# Altium schematic sheet 2016_Carte_Batteries.SchDoc
size A4
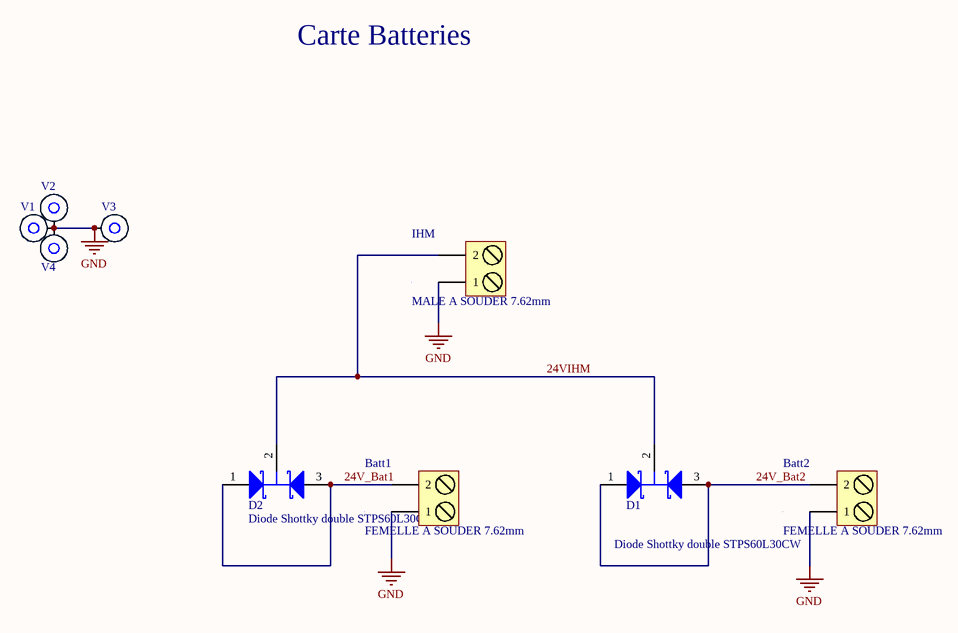
[diagram p0: 2016_Carte_Batteries.SchDoc]

## Parts
Batt1  FEMELLE A SOUDER 7.62mm  [BORNIER2_FEM_COUDE]
Batt2  FEMELLE A SOUDER 7.62mm  [BORNIER2_FEM_COUDE]
D1  Diode Shottky double STPS60L30CW  [TO247]
D2  Diode Shottky double STPS60L30CW  [TO247]
IHM  MALE A SOUDER 7.62mm  [BORNIER2_FEM_HORIZ]
V1  (no value)  [ENTRETOISE_CMS]
V2  (no value)  [ENTRETOISE_CMS]
V3  (no value)  [ENTRETOISE_CMS]
V4  (no value)  [ENTRETOISE_CMS]

## Nets
GND: Batt1.1 Batt2.1 IHM.1 V1.1 V2.1 V3.1 V4.1
24V_Bat1: Batt1.2 D2.1(A1) D2.3(A2)
24V_Bat2: Batt2.2 D1.1(A1) D1.3(A2)
24VIHM: D1.2(K) D2.2(K) IHM.2

## Notes on the sheet
- Carte Batteries
- Title
- Size:
- Date:
- A4
- Number:
- Time:
- Revision:
- Sheet
- of
- File:

## Library data of the parts
Batt1 Batt2 IHM = BORNIER2: Terminal blocks, 2 pins, pitch=5mm
D1 D2 = Diode Shottky double STPS60L30CW: DIODE SCHOTTKY DOUBLE; Manufacturer Part Number: BAT54C; Manufacturer: ZETEX; Diode Case Style: SOT-23; Supplier Part Number: 9526501; Supplier: Farnell; ComponentLink1URL: http://www.farnell.com/datasheets/27632.pdf; ComponentLink1Description: http://www.farnell.com/datasheets/27632.pdf; Pricing: 5=0,32, 25=0,23, 100=0,198, 1000=0,154 (EUR); RoHS: YES
V1-V4 = Entretoise WURTH CMS: Entretoise Wurth; Publisher: Damien Guitton